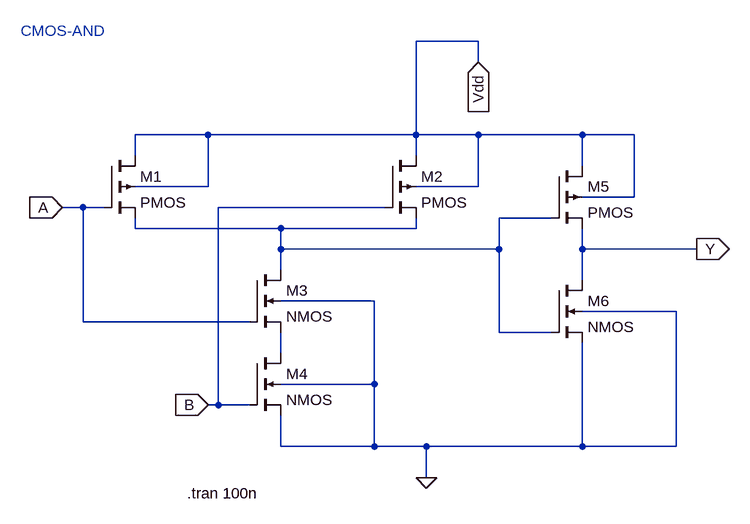
[diagram p0: schematic CMOS_and.asc]
CMOS_and.asc, the LTspice schematic file:
Version 4
SHEET 1 976 700
WIRE 544 -48 448 -48
WIRE 544 -16 544 -48
WIRE 128 96 16 96
WIRE 448 96 448 -48
WIRE 448 96 128 96
WIRE 544 96 448 96
WIRE 704 96 544 96
WIRE 784 96 704 96
WIRE 16 128 16 96
WIRE 448 128 448 96
WIRE 704 144 704 96
WIRE 128 176 128 96
WIRE 128 176 16 176
WIRE 544 176 544 96
WIRE 544 176 448 176
WIRE 784 192 784 96
WIRE 784 192 704 192
WIRE -64 208 -96 208
WIRE -32 208 -64 208
WIRE 400 208 144 208
WIRE 656 224 576 224
WIRE 16 240 16 224
WIRE 240 240 16 240
WIRE 448 240 448 224
WIRE 448 240 240 240
WIRE 240 272 240 240
WIRE 576 272 576 224
WIRE 576 272 240 272
WIRE 704 272 704 240
WIRE 880 272 704 272
WIRE 240 304 240 272
WIRE 704 320 704 272
WIRE 384 352 240 352
WIRE 848 368 704 368
WIRE -64 384 -64 208
WIRE 192 384 -64 384
WIRE 576 400 576 272
WIRE 656 400 576 400
WIRE 240 432 240 400
WIRE 384 480 384 352
WIRE 384 480 240 480
WIRE 144 512 144 208
WIRE 144 512 128 512
WIRE 192 512 144 512
WIRE 240 576 240 528
WIRE 384 576 384 480
WIRE 384 576 240 576
WIRE 464 576 384 576
WIRE 704 576 704 416
WIRE 704 576 464 576
WIRE 848 576 848 368
WIRE 848 576 704 576
WIRE 464 624 464 576
FLAG -96 208 A
IOPIN -96 208 In
FLAG 128 512 B
IOPIN 128 512 In
FLAG 464 624 0
FLAG 880 272 Y
IOPIN 880 272 Out
FLAG 544 -16 Vdd
IOPIN 544 -16 In
SYMBOL pmos4 -32 128 R0
SYMATTR InstName M1
SYMBOL pmos4 400 128 R0
SYMATTR InstName M2
SYMBOL nmos4 192 304 R0
SYMATTR InstName M3
SYMBOL nmos4 192 432 R0
SYMATTR InstName M4
SYMBOL pmos4 656 144 R0
SYMATTR InstName M5
SYMBOL nmos4 656 320 R0
SYMATTR InstName M6
TEXT 96 648 Left 2 !.tran 100n
TEXT -160 -64 Left 2 ;CMOS-AND

The netlist it stands for:
* CMOS_and.asc
M1 Vdd A N001 Vdd PMOS
M2 Vdd B N001 Vdd PMOS
M3 N001 A N002 0 NMOS
M4 N002 B 0 0 NMOS
M5 Vdd N001 Y Vdd PMOS
M6 Y N001 0 0 NMOS
.model NMOS NMOS
.model PMOS PMOS
.lib standard.mos
.tran 100n
* CMOS-AND
.backanno
.end